# Altium schematic sheet PLWD_LTE_Power.SchDoc: Power
size A3; Date: Not used; ApprovedBy: Not used; CheckedBy: Not used; Author: Not used; CompanyName: STMicroelectronics; DrawnBy: Not used; Engineer: Not used; Organization: Not used; Address1: Not used; Address2: Not used; Address3: Not used; Address4: Not used; DocumentNumber: 3; Revision: Not used; SheetNumber: 7; SheetTotal: 11; CurrentTime: Not used; CurrentDate: Not used; Time: Not used; DocumentFullPathAndName: Not used; DocumentName: Not used; ModifiedDate: Not used; ImagePath: Not used; ProjectName: Not used; Application_BuildNumber: Not used
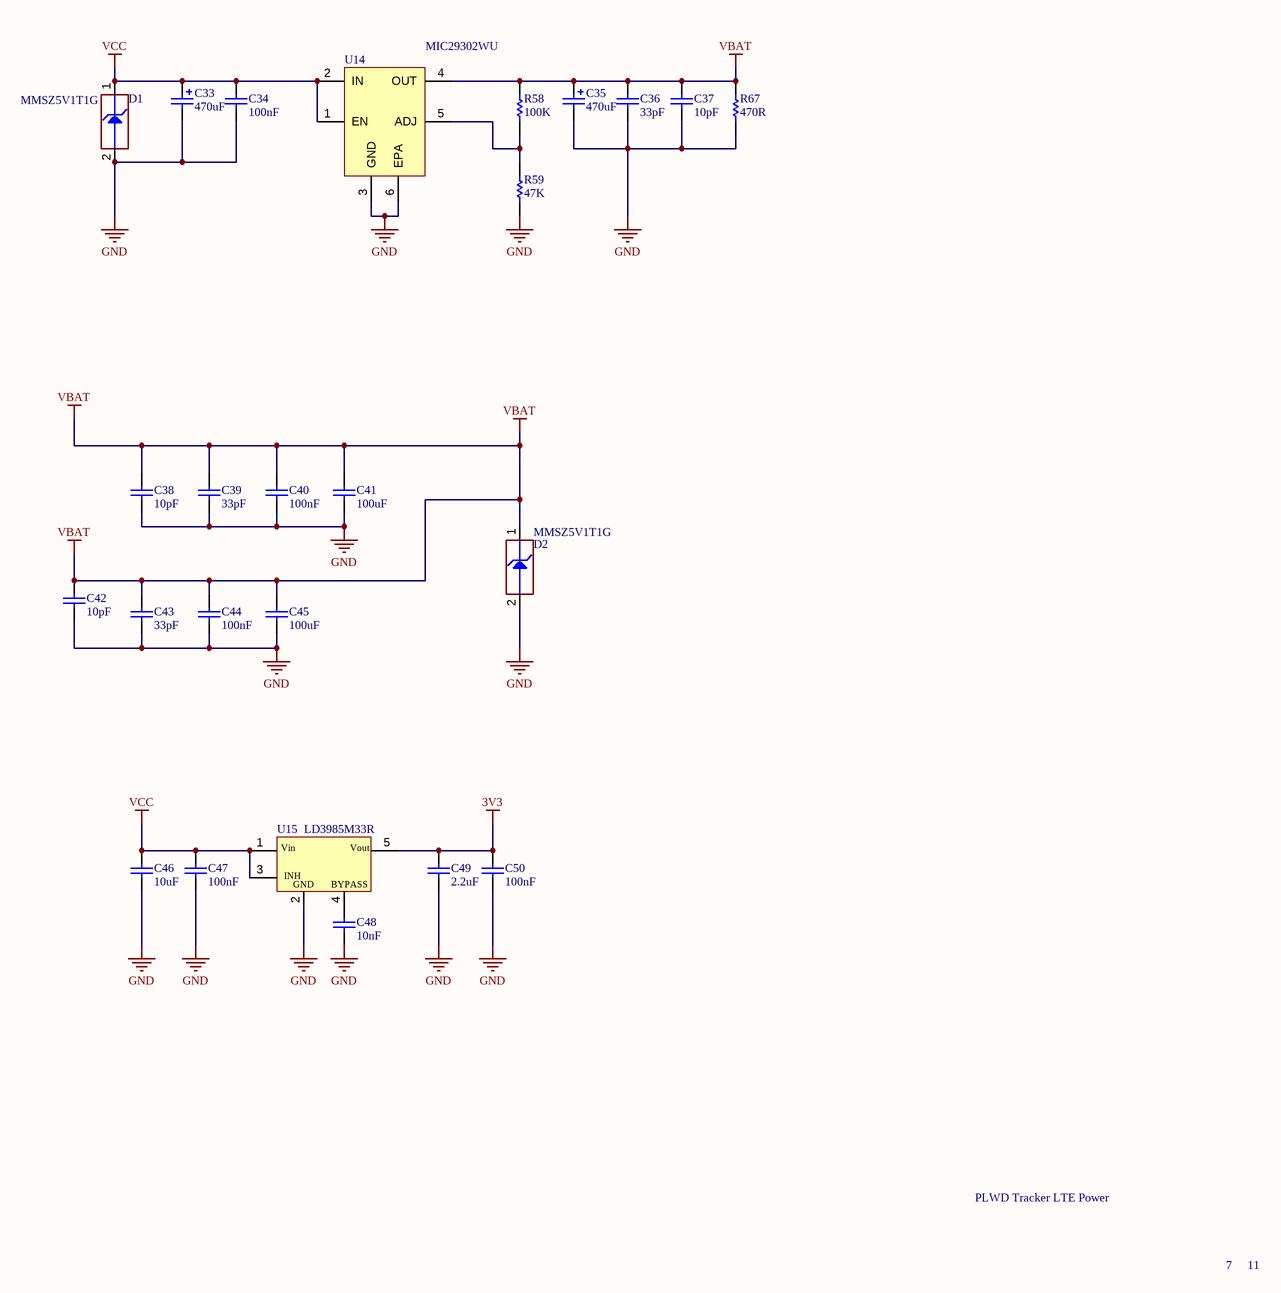
[diagram p0: PLWD_LTE_Power.SchDoc]

## Parts
C33  value 470uF  [CPOL_SANIO_TPB-D4_H380]  (hidden comment: Cap_POL_TANA)
C34  value 100nF  [C0402]  (hidden comment: Capacitor)
C35  value 470uF  [CPOL_SANIO_TPB-D4_H380]  (hidden comment: Cap_POL_TANA)
C36  value 33pF  [C0402]  (hidden comment: Capacitor)
C37  value 10pF  [C0402]  (hidden comment: Capacitor)
C38  value 10pF  [C0402]  (hidden comment: Capacitor)
C39  value 33pF  [C0402]  (hidden comment: Capacitor)
C40  value 100nF  [C0402]  (hidden comment: Capacitor)
C41  value 100uF  [C1210]  (hidden comment: Capacitor)
C42  value 10pF  [C0402]  (hidden comment: Capacitor)
C43  value 33pF  [C0402]  (hidden comment: Capacitor)
C44  value 100nF  [C0402]  (hidden comment: Capacitor)
C45  value 100uF  [C1210]  (hidden comment: Capacitor)
C46  value 10uF  [C0603]  (hidden comment: Capacitor)
C47  value 100nF  [C0402]  (hidden comment: Capacitor)
C48  value 10nF  [C0402]  (hidden comment: Capacitor)
C49  value 2.2uF  [C0603]  (hidden comment: Capacitor)
C50  value 100nF  [C0402]  (hidden comment: Capacitor)
D1  MMSZ5V1T1G  [DIOZ_SOD123_1K_2A]
D2  MMSZ5V1T1G  [DIOZ_SOD123_1K_2A]
R58  value 100K  [R0402]  (hidden comment: Resistor)
R59  value 47K  [R0402]  (hidden comment: Resistor)
R67  value 470R  [R0402]  (hidden comment: Resistor)
U14  MIC29302WU  [LDO_TO263-5L-EPAD_D2PAK_P170]
U15  LD3985M33R  [REG_SOT23-5L]

## Nets
3V3: C49.2 C50.2 U15.5(Vout)
GND: C33.2 C34.2 C35.2 C36.1 C37.1 C38.1 C39.1 C40.2 C41.1 C42.1 C43.1 C44.2 C45.1 C46.1 C47.1 C48.2 C49.1 C50.1 D1.2(A) D2.2(A) R59.1 R67.1 U14.3(GND) U14.6(EPA) U15.2(GND)
VBAT: C35.1 C36.2 C37.2 C38.2 C39.2 C40.1 C41.2 C42.2 C43.2 C44.1 C45.2 D2.1(K) R58.2 R67.2 U14.4(OUT)
VCC: C33.1 C34.1 C46.2 C47.2 D1.1(K) U14.1(EN) U14.2(IN) U15.1(Vin) U15.3(CE)
NetC48_1: C48.1 U15.4(BYPASS)
NetR58_1: R58.1 R59.2 U14.5(ADJ)

## Notes on the sheet
- PLWD Tracker LTE Power
- 7
- 11
- DWG NO:
- REV:
- THIS DOCUMENT AND THE DATA DISCLOSED HEREIN OR
- HEREWITH IS THE PROPERTY OF ALTIUM LIMITED AND MAY
- BE FREELY DISTRIBUTED IN WHOLE. NO RIGHTS ARE
- RESERVED OR EXPRESS OR IMPLIED WARANTEE GIVEN.
- REVISION
- DESCRIPTION
- DATE
- APPROVED
- ENG:
- APPROVALS
- PROJECT
- DSN:
- CHK:
- REFERENCE DOCUMENTS
- PROJECT REVISION:
- TITLE
- DOCUMENT REVISION:
- DESIGN ITEM:
- BOM:
- FAB DWG:
- PCB DWG:
- ASSY DWG:
- SCALE:
- A2
- SIZE
- CAGE CODE
- FILE NAME
- DWG NO.
- SHEET
- OF
- REV
- (in symbol MCD-00086) INH

## Library data of the parts
C33 C35 = MCD-00278: capacitor 470uF 6,3V 20% SANYO; Manufacturer_Part_Number: 6TPB470M; Provided_By: Subcon; Revision: July-2002: Re-released for DXP Platform.; Internal_Part_Number: MCD-00278; PartType: CAP; Manufacturer: SANYO; ComponentLink1Description: TPB_Series.pdf
C34 C40 C44 C47 C50 = MCD-00006: Capacitor,100nF,16V,X7R,10%,0402,YAGEO; Manufacturer_Part_Number: CC0402KRX7R7BB104; Provided_By: Subcon; Internal_Part_Number: MCD-00006; PartType: Capacitors; Manufacturer: YAGEO; ComponentLink1Description: Yageo_Capacitor_X7R-series.pdf; ComponentLink1URL: Yageo_Capacitor_X7R-series.pdf; ECCN_US: n/a; ECCN_EU: n/a
C36 C39 C43 = MCD-00277: capacitor 33pF 50V 5% 0402 COG YAGEO; Manufacturer_Part_Number: CC0402JRNPO9BN330; Provided_By: Subcon; Internal_Part_Number: MCD-00277; PartType: CAP; Manufacturer: YAGEO; ComponentLink1Description: Yageo_COG_series.pdf
C37 C38 C42 = MCD-00015: Capacitor,10pF,50V,NPO,5%,0402,YAGEO; Manufacturer_Part_Number: CC0402JRNPO9BN100; Provided_By: subcon; Internal_Part_Number: MCD-00015; PartType: Capacitors; ComponentLink1URL: Yageo_Capacitor_NP0_16V-to-50V.pdf; ECCN_US: n/a; ECCN_EU: n/a; Manufacturer: YAGEO; ComponentLink1Description: Yageo_Capacitor_NP0_16V-to-50V.pdf
C41 C45 = MCD-00103: Capacitor,100uF,6V3,X5R,10%,1210; Manufacturer_Part_Number: 12106D107KAT2A; Manufacturer: AVX; Internal_Part_Number: MCD-00103; PartType: Capacitors; ComponentLink1Description: 12106D107KAT2A
C46 = MCD-00243: Capacitor,10uF,6V3,X5R,10%,0603,YAGEO; Manufacturer_Part_Number: CC0603KRX5R5BB106; Provided_By: Subcon; Internal_Part_Number: MCD-00243; PartType: Capacitors; Manufacturer: YAGEO; ComponentLink1Description: Yageo_Capacitor_X5R-series.pdf; ComponentLink1URL: Yageo_Capacitor_X5R-series.pdf; ECCN_US: n/a; ECCN_EU: n/a
C48 = MCD-00011: Capacitor,10nF,16V,X7R,10%,0402,YAGEO; Manufacturer_Part_Number: CC0402KRX7R7BB103; Provided_By: Subcon; Internal_Part_Number: MCD-00011; PartType: Capacitors; Manufacturer: YAGEO; ComponentLink1Description: Yageo_Capacitor_X7R-series.pdf; ComponentLink1URL: Yageo_Capacitor_X7R-series.pdf; ECCN_US: n/a; ECCN_EU: n/a
C49 = MCD-00012: Capacitor,2.2uF,10V, X5R,10%,0603,YAGEO; Manufacturer_Part_Number: CC0603KRX5R6BB225; Alternate_Manufacturer_Part_Number: C0603C225K8PACTU; Alternate_Manufacturer: KEMET; Provided_By: Subcon; Internal_Part_Number: MCD-00012; PartType: Capacitors; Manufacturer: YAGEO; ComponentLink1Description: Yageo_Capacitor_X5R-series.pdf; ComponentLink1URL: Yageo_Capacitor_X5R-series.pdf; ComponentLink2Description: KEMET_Capacitor_X7R-series.pdf; ComponentLink2URL: KEMET_Capacitor_X7R-series.pdf; ECCN_US: n/a; ECCN_EU: n/a
D1 D2 = MCD-00330: Diode zener; Manufacturer: Onsemi; Provided_By: Subcon; Internal_Part_Number: MCD-00330; Value: MMSZ5V1T1G; PartType: ICS; Manufacturer_Part_Number: MMSZ5V1T1G; ComponentLink1Description: MMSZ5V1T1G.pdf
R58 = MCD-00059: Resistor,100K,0402,1%,YAGEO; Manufacturer_Part_Number: RC0402FR-07100KL; Alternate_Manufacturer_Part_Number: RT0402FRE07100KL; Provided_By: Subcon; Internal_Part_Number: MCD-00059; PartType: Resistors; ComponentLink1URL: Yageo_Resistor_RC0402-series.pdf; ECCN_US: n/a; ECCN_EU: n/a; Manufacturer: YAGEO; Alternate_Manufacturer: YAGEO; ComponentLink1Description: Yageo_Resistor_RC0402-series.pdf
R59 = MCD-00063: Resistor,47K,0402,1%,YAGEO; Manufacturer_Part_Number: RC0402FR-0747KL; Provided_By: Subcon; Internal_Part_Number: MCD-00063; PartType: Resistors; ComponentLink1URL: Yageo_Resistor_RC0402-series.pdf; ECCN_US: n/a; ECCN_EU: n/a; Manufacturer: YAGEO; ComponentLink1Description: Yageo_Resistor_RC0402-series.pdf
R67 = MCD-00178: Resistor,470R,0402,1%,YAGEO; Manufacturer_Part_Number: RC0402FR-07470RL; Provided_By: Subcon; Internal_Part_Number: MCD-00178; PartType: Resistors; ComponentLink1URL: Yageo_Resistors_RC0402; Manufacturer: YAGEO; ComponentLink1Description: Yageo_Resistors_RC0402
U14 = MCD-00283: LDO Ajustable, VOUT=1V25-to-25V,3A,VINmax=26V; Manufacturer: MICREL; Provided_By: Subcon; Internal_Part_Number: MCD-00283; Value: MIC29302WU; PartType: ICS; Manufacturer_Part_Number: MIC29302WU; ComponentLink1Description: MIC29302WU,pdf
U15 = MCD-00086: Ultra low drop-low noise BiCMOS voltage, regulators low ESR capacitors compatible; Manufacturer: STM; ECCN_US: EAR99; ECCN_EU: NEC; Internal_Part_Number: MCD-00086; Value: LD3985M33R; PartType: IC; Manufacturer_Part_Number: LD3985M33R; ComponentLink1Description: STM_LDO_LD3985.pdf; ComponentLink1URL: STM_LDO_LD3985.pdf; Provided_By: STM